# Altium schematic sheet Sheet1.SchDoc
size B
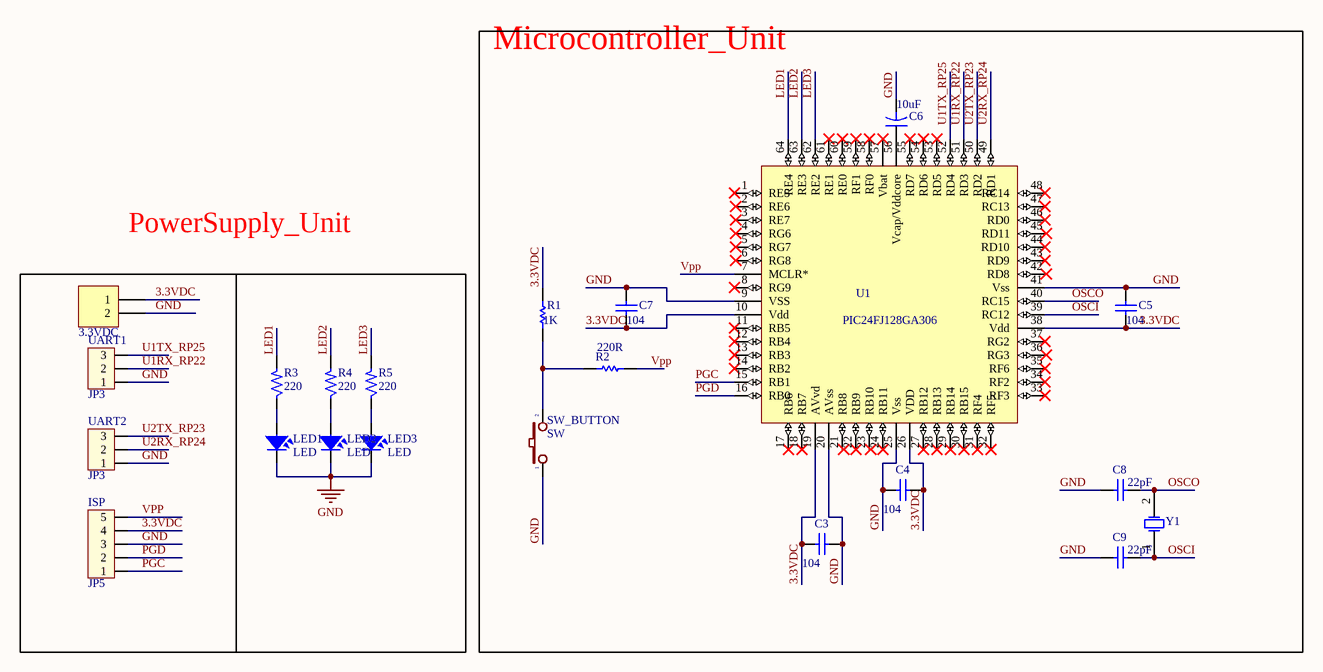
[diagram p0: Sheet1.SchDoc]

## Parts
3.3VDC  Header 2  [HDR1X2]  (value not drawn)
C3  value 104  [C0805]  (hidden comment: Cap)
C4  value 104  [C0805]  (hidden comment: Cap)
C5  value 104  [C0805]  (hidden comment: Cap)
C6  value 10uF  [CAP 1uF SMD]  (hidden comment: Cap2)
C7  value 104  [C0805]  (hidden comment: Cap)
C8  value 22pF  [C1206]  (hidden comment: Cap)
C9  value 22pF  [C1206]  (hidden comment: Cap)
ISP  JP5  [CON5]
LED1  LED  [SM-LED-GEEN]
LED2  LED  [SM-LED-GEEN]
LED3  LED  [SM-LED-GEEN]
R1  value 1K  [SM-1206]  (hidden comment: Res1)
R2  value 220R  [SM-1206]  (hidden comment: res)
R3  220  [SM-1206]
R4  220  [SM-1206]
R5  220  [SM-1206]
SW_BUTTON  SW  [SW2]
U1  PIC24FJ128GA306  [TQFP64_10X10MC]
UART1  JP3  [CON3]
UART2  JP3  [CON3]
Y1  XTAL  [XT455k]  (value not drawn)

## Blocks framed on the sheet
Microcontroller_Unit: C3-C9 R1 R2 SW_BUTTON U1 Y1

## Nets
GND: 3.3VDC.2 C3.2 C4.1 C5.2 C6.2 C7.2 C8.1 C9.1 ISP.3 LED1.2 LED2.2 LED3.2 SW_BUTTON.1 U1.9(VSS) U1.20(AVss) U1.25(Vss) U1.41(Vss) UART1.1 UART2.1
3.3VDC: 3.3VDC.1 C3.1 C4.2 C5.1 C7.1 ISP.4 R1.2 U1.10(Vdd) U1.19(AVvd) U1.26(VDD) U1.38(Vdd)
LED1: R3.2 U1.64(RE4)
LED2: R4.2 U1.63(RE3)
LED3: R5.2 U1.62(RE2)
OSCI: C9.2 U1.39(RC12) Y1.1(OSC1)
OSCO: C8.2 U1.40(RC15) Y1.2(OSC2)
PGC: ISP.1 U1.15(RB1)
PGD: ISP.2 U1.16(RB0)
U1RX_RP22: U1.51(RD3) UART1.2
U1TX_RP25: U1.52(RD4) UART1.3
U2RX_RP24: U1.49(RD1) UART2.2
U2TX_RP23: U1.50(RD2) UART2.3
Vpp: ISP.5 R2.2 U1.7(MCLR*)
NetC6_1: C6.1 U1.56(Vcap/Vddcore)
NetLED1_1: LED1.1 R3.1
NetLED2_1: LED2.1 R4.1
NetLED3_1: LED3.1 R5.1
NetR1_1: R1.1 R2.1 SW_BUTTON.2

Not connected (* = marked no-connect by the designer): U1 1(RE5)* 2(RE6) 3(RE7) 4(RG6) 5(RG7) 6(RG8) 8(RG9)* 11(RB5)* 12(RB4)* 13(RB3)* 14(RB2)* 17(RB6)* 18(RB7)* 21(RB8) 22(RB9)* 23(RB10) 24(RB11)* 27(RB12)* 28(RB13)* 29(RB14)* 30(RB15)* 31(RF4)* 32(RF5)* 33(RF3)* 34(RF2)* 35(RF6)* 36(RG3) 37(RG2)* 42(RD8) 43(RD9)* 44(RD10)* 45(RD11) 46(RD0)* 47(RC13)* 48(RC14)* 53(RD5)* 54(RD6)* 55(RD7)* 57(Vbat)* 58(RF0)* 59(RF1)* 60(RE0)* 61(RE1)*

## Notes on the sheet
- PowerSupply_Unit
- Title
- Size:
- Date:
- B
- Number:
- Time:
- Revision:
- Sheet
- of
- File:

## Library data of the parts
3.3VDC = Header 2: Header, 2-Pin; LatestRevisionDate: 17-Jul-2002; LatestRevisionNote: Re-released for DXP Platform.; Publisher: Altium Limited
C3-C5 C7-C9 = Cap: Capacitor; Published: 8-Jun-2000; LatestRevisionDate: 17-Jul-2002; LatestRevisionNote: Re-released for DXP Platform.; PackageReference: RAD-0.3; Publisher: Altium Limited; PackageDescription: Radial Cap, Thru-Hole; 2 Leads; 0.3 in Pin Spacing
C6 = Cap2: Capacitor; Published: 23-Sep-2002; PackageReference: CAPR5-4X5; Publisher: Altium Limited; PackageDescription: Capacitor; 2 Leads
ISP = Con5: Connector 5; Value: Connector 5
LED1-LED3 = LED: LED Single colour Green and Red; Value: LED 3 ly Single Colour
R1 R2 = Res1: Resistor; Published: 8-Jun-2000; LatestRevisionDate: 17-Jul-2002; LatestRevisionNote: Re-released for DXP Platform.; PackageReference: AXIAL-0.3; Publisher: Altium Limited; PackageDescription: Axial Device, Thru-Hole; 2 Leads; 0.3 in Pin Spacing
R3-R5 = R: Resistor 1/4W; Value: R1/4W - 1K
SW_BUTTON = SW2: Switch button 2 pin; Value: SW chip 2 pin
UART1 UART2 = Con3: Connector 3; Value: Connector 3
Y1 = XTAL: Crystal Oscillator; Published: 8-Jun-2000; LatestRevisionDate: 17-Jul-2002; LatestRevisionNote: Re-released for DXP Platform.; PackageReference: R38; Publisher: Altium Limited; PackageDescription: Crystal, Thru-Hole; 2 Leads; Body 3.1 x 8.2 mm (Dia.xH)